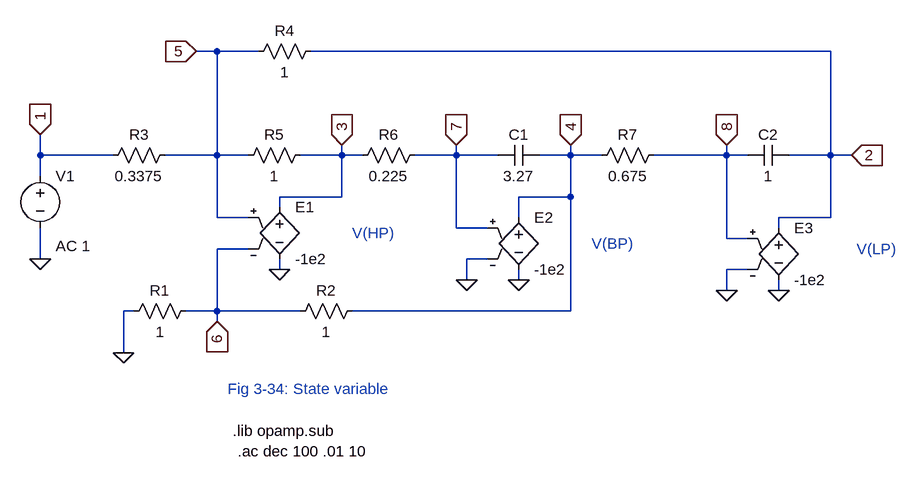
[diagram p0: schematic state_variable_filter_VCVS.asc]
state_variable_filter_VCVS.asc, the LTspice schematic file:
Version 4
SHEET 1 1784 776
WIRE 112 -16 80 -16
WIRE 176 -16 112 -16
WIRE 1056 -16 256 -16
WIRE -160 144 -160 112
WIRE -48 144 -160 144
WIRE 112 144 112 -16
WIRE 112 144 32 144
WIRE 160 144 112 144
WIRE 304 144 304 128
WIRE 304 144 240 144
WIRE 336 144 304 144
WIRE 480 144 480 128
WIRE 480 144 416 144
WIRE 544 144 480 144
WIRE 656 144 656 128
WIRE 656 144 608 144
WIRE 704 144 656 144
WIRE 896 144 896 128
WIRE 896 144 784 144
WIRE 928 144 896 144
WIRE 1056 144 1056 -16
WIRE 1056 144 992 144
WIRE 1088 144 1056 144
WIRE -160 176 -160 144
WIRE 304 208 304 144
WIRE 304 208 208 208
WIRE 656 208 656 144
WIRE 656 208 576 208
WIRE 208 224 208 208
WIRE 112 240 112 144
WIRE 160 240 112 240
WIRE 576 240 576 208
WIRE 1056 240 1056 144
WIRE 1056 240 976 240
WIRE 480 256 480 144
WIRE 528 256 480 256
WIRE 976 256 976 240
WIRE 896 272 896 144
WIRE 928 272 896 272
WIRE 160 288 112 288
WIRE -160 304 -160 256
WIRE 528 304 496 304
WIRE 208 320 208 304
WIRE 928 320 896 320
WIRE 496 336 496 304
WIRE 576 336 576 320
WIRE 896 352 896 320
WIRE 976 352 976 336
WIRE -16 384 -32 384
WIRE 112 384 112 288
WIRE 112 384 64 384
WIRE 240 384 112 384
WIRE 656 384 656 208
WIRE 656 384 320 384
WIRE 112 400 112 384
WIRE -32 448 -32 384
FLAG -160 304 0
FLAG 896 352 0
FLAG -160 112 1
IOPIN -160 112 In
FLAG 112 400 6
IOPIN 112 400 In
FLAG 80 -16 5
IOPIN 80 -16 In
FLAG 656 128 4
IOPIN 656 128 In
FLAG 304 128 3
IOPIN 304 128 In
FLAG 480 128 7
IOPIN 480 128 In
FLAG -32 448 0
FLAG 1088 144 2
IOPIN 1088 144 In
FLAG 208 320 0
FLAG 976 352 0
FLAG 496 336 0
FLAG 576 336 0
FLAG 896 128 8
IOPIN 896 128 In
SYMBOL res 48 128 R90
WINDOW 0 0 56 VBottom 2
WINDOW 3 32 56 VTop 2
SYMATTR InstName R3
SYMATTR Value 0.3375
SYMBOL res 432 128 R90
WINDOW 0 0 56 VBottom 2
WINDOW 3 32 56 VTop 2
SYMATTR InstName R6
SYMATTR Value 0.225
SYMBOL res 800 128 R90
WINDOW 0 0 56 VBottom 2
WINDOW 3 32 56 VTop 2
SYMATTR InstName R7
SYMATTR Value 0.675
SYMBOL res 256 128 R90
WINDOW 0 0 56 VBottom 2
WINDOW 3 32 56 VTop 2
SYMATTR InstName R5
SYMATTR Value 1
SYMBOL res 336 368 R90
WINDOW 0 0 56 VBottom 2
WINDOW 3 32 56 VTop 2
SYMATTR InstName R2
SYMATTR Value 1
SYMBOL cap 608 128 R90
WINDOW 0 0 32 VBottom 2
WINDOW 3 32 32 VTop 2
SYMATTR InstName C1
SYMATTR Value 3.27
SYMBOL cap 992 128 R90
WINDOW 0 0 32 VBottom 2
WINDOW 3 32 32 VTop 2
SYMATTR InstName C2
SYMATTR Value 1
SYMBOL voltage -160 160 R0
WINDOW 123 24 124 Left 2
WINDOW 39 0 0 Left 0
SYMATTR Value2 AC 1
SYMATTR InstName V1
SYMATTR Value ""
SYMBOL res 80 368 R90
WINDOW 0 0 56 VBottom 2
WINDOW 3 32 56 VTop 2
SYMATTR InstName R1
SYMATTR Value 1
SYMBOL res 272 -32 R90
WINDOW 0 0 56 VBottom 2
WINDOW 3 32 56 VTop 2
SYMATTR InstName R4
SYMATTR Value 1
SYMBOL e 208 208 R0
SYMATTR InstName E1
SYMATTR Value -1e2
SYMBOL e 976 240 R0
SYMATTR InstName E3
SYMATTR Value -1e2
SYMBOL e 576 224 R0
SYMATTR InstName E2
SYMATTR Value -1e2
TEXT 128 504 Left 2 ;Fig 3-34: State variable
TEXT 136 568 Left 2 !.lib opamp.sub
TEXT 144 600 Left 2 !.ac dec 100 .01 10
TEXT 1096 288 Left 2 ;V(LP)
TEXT 688 280 Left 2 ;V(BP)
TEXT 320 264 Left 2 ;V(HP)

The netlist it stands for:
* state_variable_filter_VCVS.asc
R3 5 1 0.3375
R6 7 3 0.225
R7 8 4 0.675
R5 3 5 1
R2 4 6 1
C1 4 7 3.27
C2 2 8 1
V1 1 0 AC 1
R1 6 0 1
R4 2 5 1
E1 3 0 5 6 -1e2
E3 2 0 8 0 -1e2
E2 4 0 7 0 -1e2
* Fig 3-34: State variable
.lib opamp.sub
.ac dec 100 .01 10
* V(LP)
* V(BP)
* V(HP)
.backanno
.end